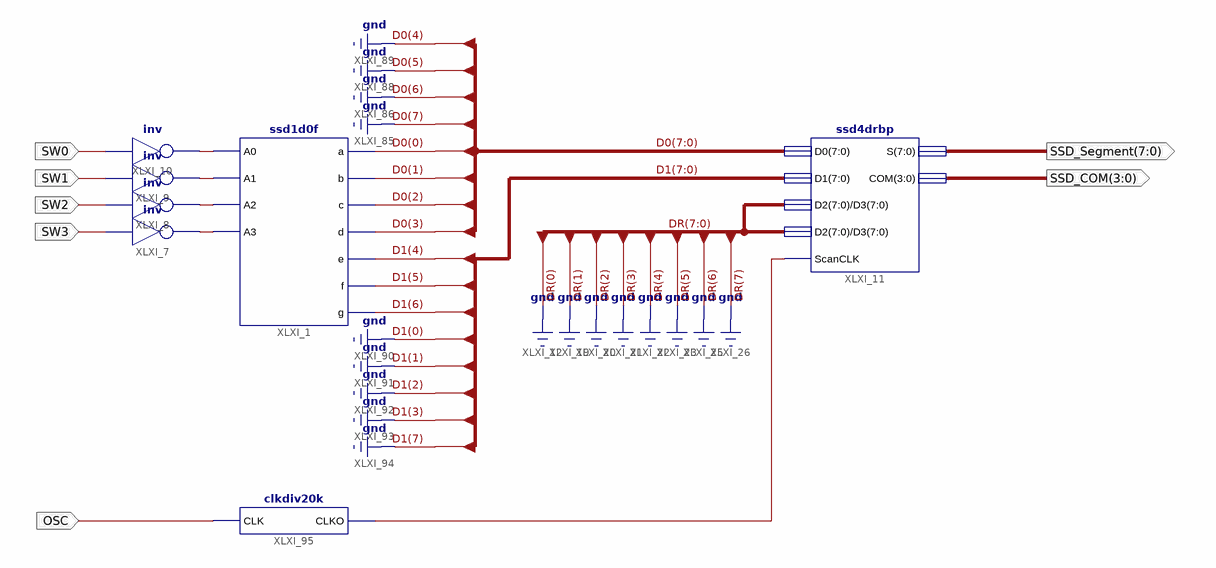
[diagram p0: schematic sheet 1]
// Xilinx ISE schematic main.sch (spartan6) as structural Verilog: 7 symbols, 7 ports
module main (
  input  SW3,
  input  SW2,
  input  SW1,
  input  SW0,
  input  OSC,
  output [3:0] SSD_COM,
  output [7:0] SSD_Segment
);

  wire XLXN_6, XLXN_7, XLXN_8, XLXN_9, XLXN_169;
  wire [3:0] D0;
  wire [6:4] D1;

  ssd1d0f XLXI_1 (
    .a(D0[0]), .A0(XLXN_9), .A1(XLXN_8), .A2(XLXN_7), .A3(XLXN_6), .b(D0[1]), .c(D0[2]), .d(D0[3]),
    .e(D1[4]), .f(D1[5]), .g(D1[6]));
  not XLXI_7 (XLXN_6, SW3);
  not XLXI_8 (XLXN_7, SW2);
  not XLXI_9 (XLXN_8, SW1);
  not XLXI_10 (XLXN_9, SW0);
  ssd4drbp XLXI_11 (
    .COM(SSD_COM), .D0({4'b0000, D0}), .D1({1'b0, D1, 4'b0000}), .D2({8{1'b0}}), .D3({8{1'b0}}),
    .S(SSD_Segment), .ScanCLK(XLXN_169));
  clkdiv20k XLXI_95 (.CLK(OSC), .CLKO(XLXN_169));
endmodule
